# Altium schematic sheet ADCS2Umb_2.SchDoc
size A
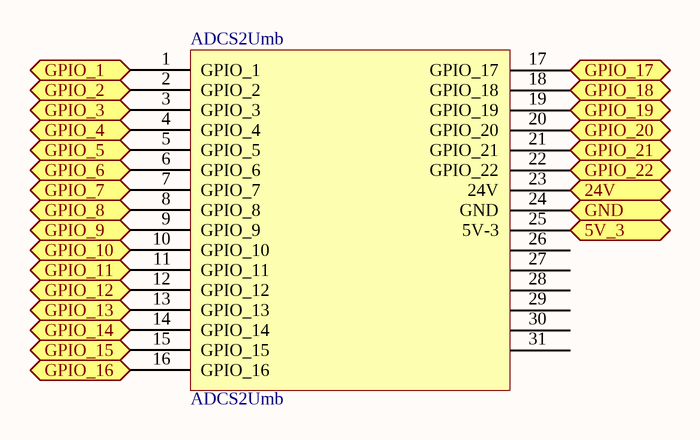
[diagram p0: ADCS2Umb_2.SchDoc]

## Parts
ADCS2Umb  ADCS2Umb  [ADCS2Umb]

## Ports
5V_3 (bidir), 24V (bidir), GND (bidir), GPIO_1 (bidir), GPIO_2 (bidir), GPIO_3 (bidir), GPIO_4 (bidir), GPIO_5 (bidir), GPIO_6 (bidir), GPIO_7 (bidir), GPIO_8 (bidir), GPIO_9 (bidir), GPIO_10 (bidir), GPIO_11 (bidir), GPIO_12 (bidir), GPIO_13 (bidir), GPIO_14 (bidir), GPIO_15 (bidir), GPIO_16 (bidir), GPIO_17 (bidir), GPIO_18 (bidir), GPIO_19 (bidir), GPIO_20 (bidir), GPIO_21 (bidir), GPIO_22 (bidir)

## Nets
5V_3: ADCS2Umb.25(5V-3) ; port 5V_3
24V: ADCS2Umb.23(24V) ; port 24V
GND: ADCS2Umb.24(GND) ; port GND
GPIO_1: ADCS2Umb.1(GPIO_1) ; port GPIO_1
GPIO_2: ADCS2Umb.2(GPIO_2) ; port GPIO_2
GPIO_3: ADCS2Umb.3(GPIO_3) ; port GPIO_3
GPIO_4: ADCS2Umb.4(GPIO_4) ; port GPIO_4
GPIO_5: ADCS2Umb.5(GPIO_5) ; port GPIO_5
GPIO_6: ADCS2Umb.6(GPIO_6) ; port GPIO_6
GPIO_7: ADCS2Umb.7(GPIO_7) ; port GPIO_7
GPIO_8: ADCS2Umb.8(GPIO_8) ; port GPIO_8
GPIO_9: ADCS2Umb.9(GPIO_9) ; port GPIO_9
GPIO_10: ADCS2Umb.10(GPIO_10) ; port GPIO_10
GPIO_11: ADCS2Umb.11(GPIO_11) ; port GPIO_11
GPIO_12: ADCS2Umb.12(GPIO_12) ; port GPIO_12
GPIO_13: ADCS2Umb.13(GPIO_13) ; port GPIO_13
GPIO_14: ADCS2Umb.14(GPIO_14) ; port GPIO_14
GPIO_15: ADCS2Umb.15(GPIO_15) ; port GPIO_15
GPIO_16: ADCS2Umb.16(GPIO_16) ; port GPIO_16
GPIO_17: ADCS2Umb.17(GPIO_17) ; port GPIO_17
GPIO_18: ADCS2Umb.18(GPIO_18) ; port GPIO_18
GPIO_19: ADCS2Umb.19(GPIO_19) ; port GPIO_19
GPIO_20: ADCS2Umb.20(GPIO_20) ; port GPIO_20
GPIO_21: ADCS2Umb.21(GPIO_21) ; port GPIO_21
GPIO_22: ADCS2Umb.22(GPIO_22) ; port GPIO_22

Not connected (* = marked no-connect by the designer): ADCS2Umb 26 27 28 29 30 31

## Library data of the parts
ADCS2Umb = ADCS2Umb: Part Number: 501571-4007; pin to pad: 1>A1 2>A2 3>A3 4>A4 5>A5 6>A6 7>A7 8>A8 9>A9 10>A10 11>A11 12>A12 13>A13 14>A14 15>A15 16>A16 17>A17 18>A18 19>A19 20>A20 21>A21 22>A22 23>A23 24>A24 25>A25 26>A26 27>A27 28>A28 29>A29 30>A30 31>A31